# EasyEDA Pro project ACS Core.eprj, schematic RGB Screen
Board Name: RGB Screen; Create Date: 2026-01-16; Page Name: P1; Project Name: ACS Core; Schematic Name: RGB Screen; Update Date: 2026-01-16; Company: EasyEDA.com; Page Size: A4; Version: V1.0
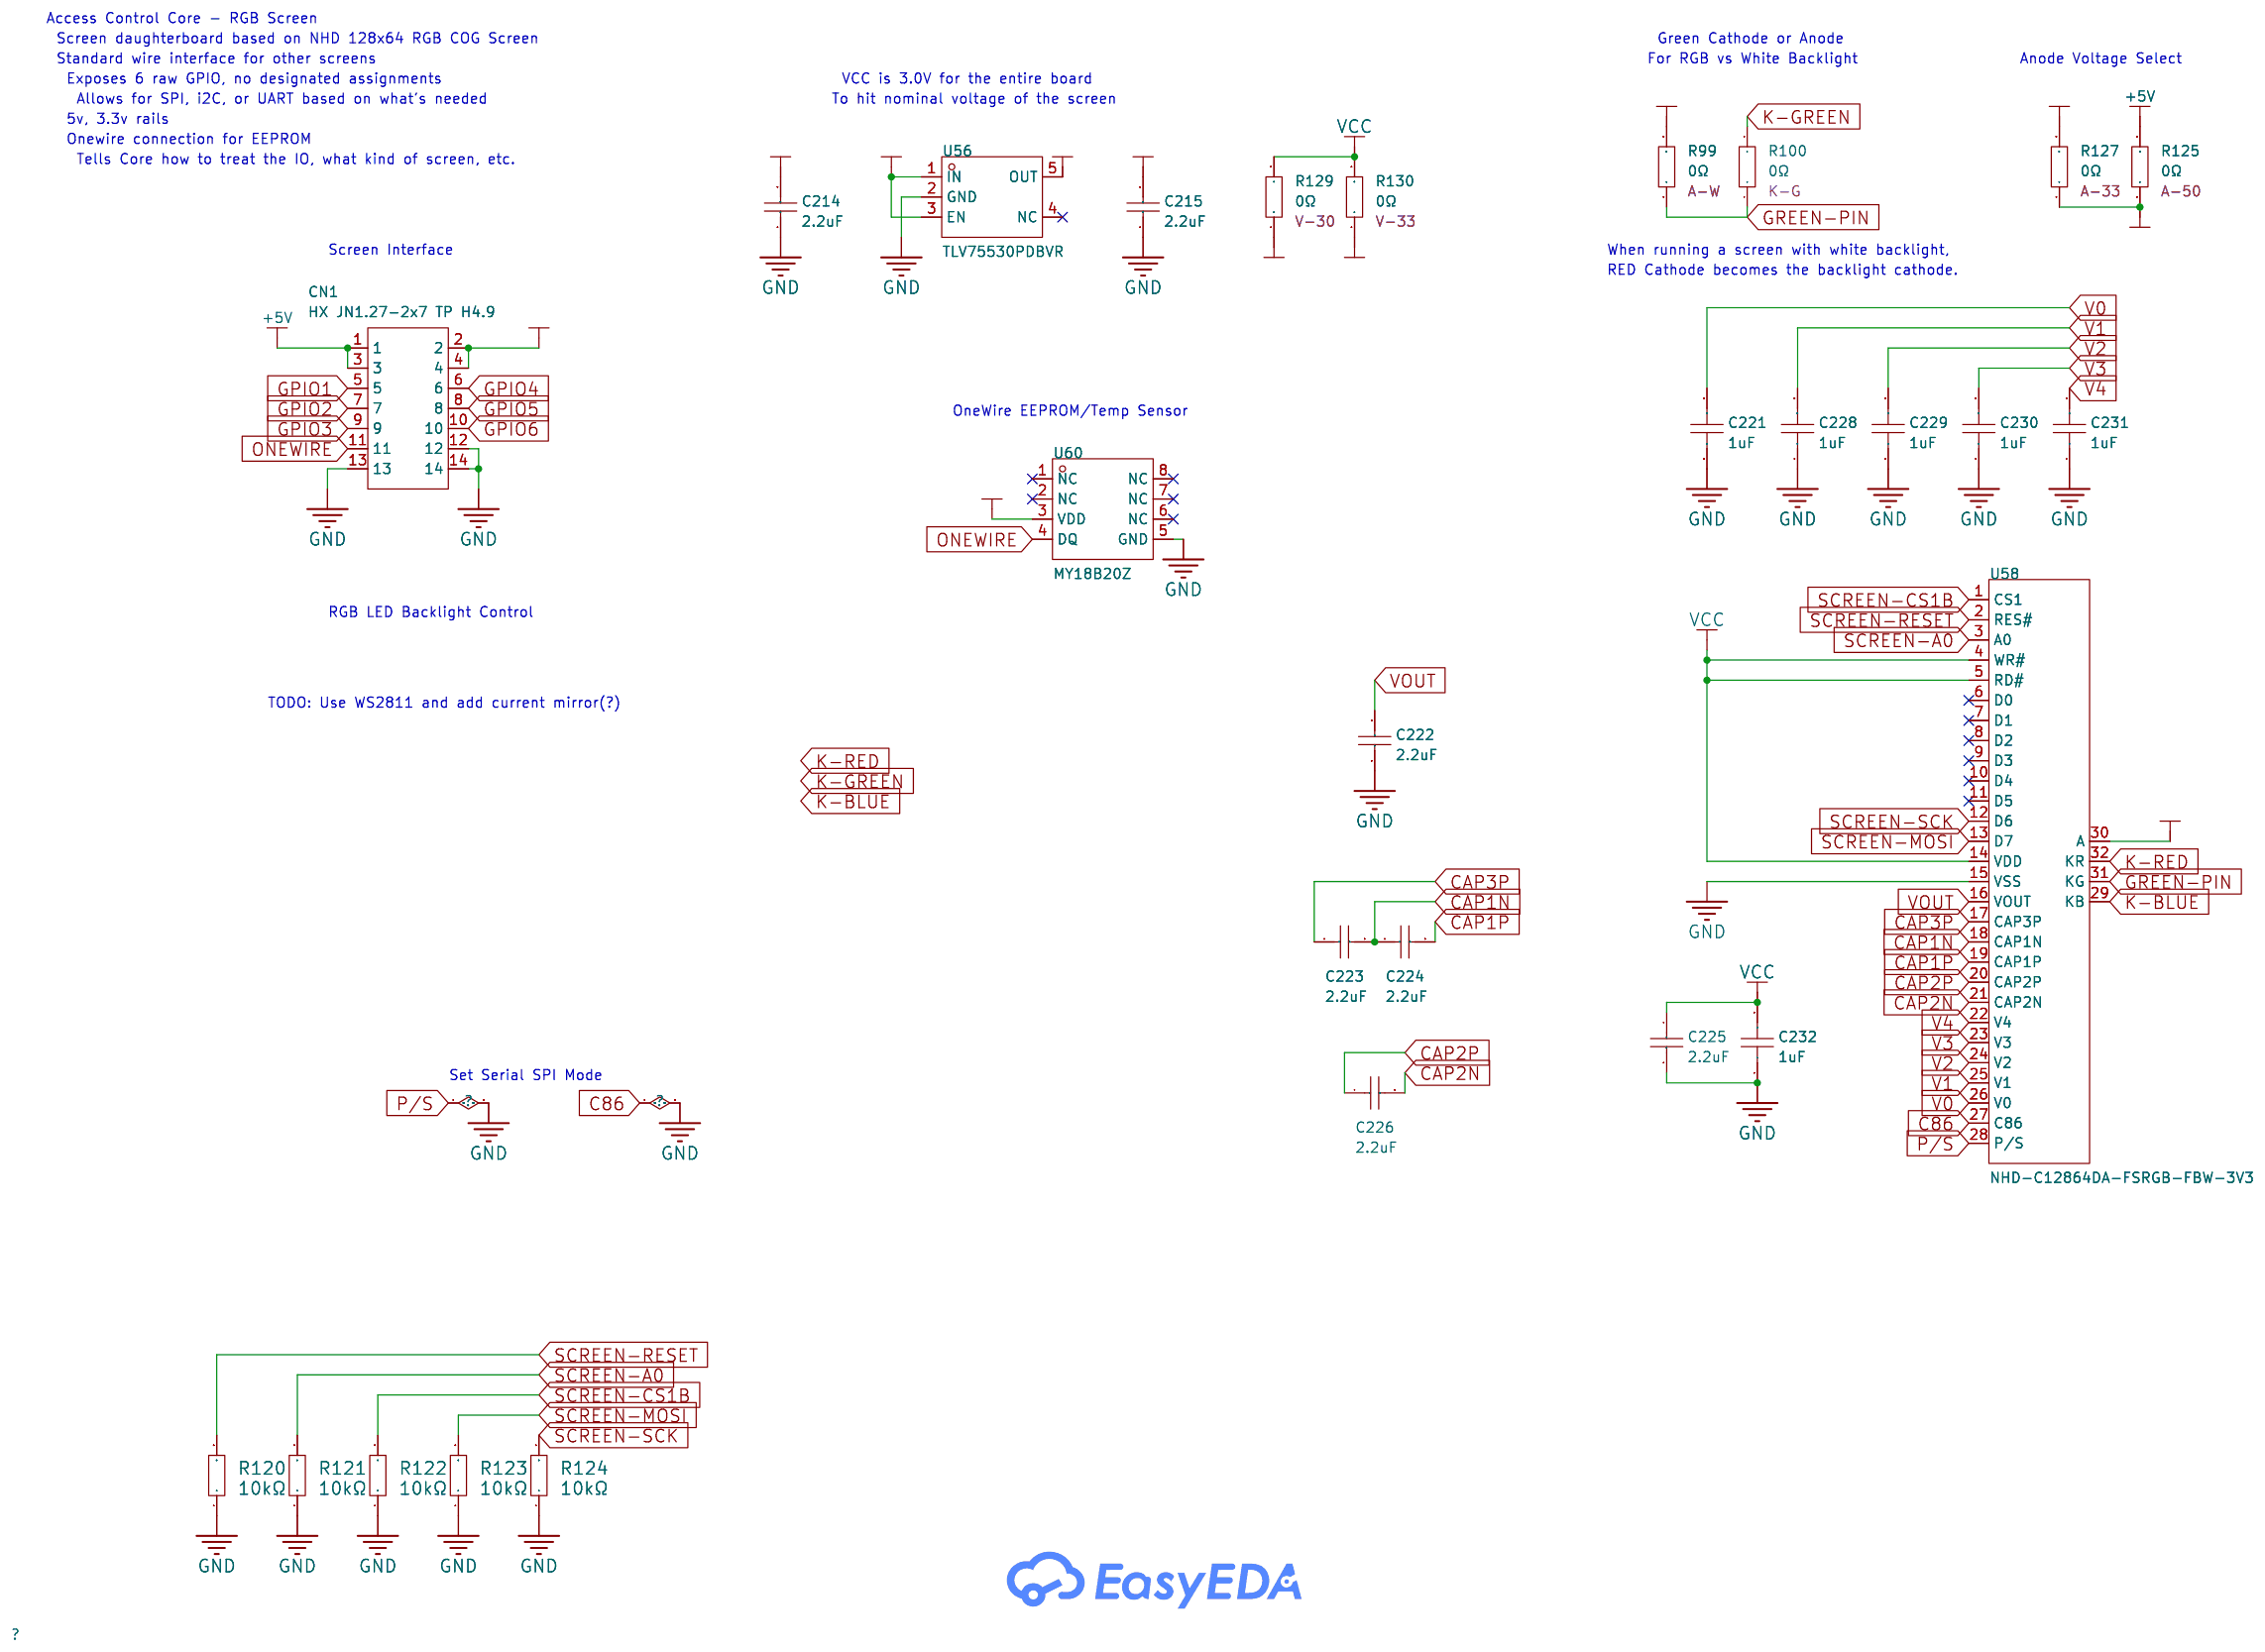
[diagram p6: schematic sheet]

## Parts
C214  2.2uF  [C0603]
C215  2.2uF  [C0603]
C221  1uF  [C0603]
C222  2.2uF  [C0603]
C223  2.2uF  [C0603]
C224  2.2uF  [C0603]
C225  2.2uF  [C0603]
C226  2.2uF  [C0603]
C228  1uF  [C0603]
C229  1uF  [C0603]
C230  1uF  [C0603]
C231  1uF  [C0603]
C232  1uF  [C0603]
CN1  HX JN1.27-2x7 TP H4.9  [IDC-SMD_14P-P1.27_HXJN1.27-14P]
R99  0Ω  [R0805]  (no BOM)
R100  0Ω  [R0805]
R120  10kΩ  [R0603]
R121  10kΩ  [R0603]
R122  10kΩ  [R0603]
R123  10kΩ  [R0603]
R124  10kΩ  [R0603]
R125  0Ω  [R0805]  (no BOM)
R127  0Ω  [R0805]
R129  0Ω  [R0805]
R130  0Ω  [R0805]  (no BOM)
U56  TLV75530PDBVR  [SOT-23-5_L3.0-W1.7-P0.95-LS2.8-BR]
U58  NHD-C12864DA-FSRGB-FBW-3V3  [LCD-TH_L58.2-W41.7-P1.27_NHD-C12864DA-FSRGB-FBW-3V3]
U60  MY18B20Z  [SOP-8_L4.9-W3.9-P1.27-LS6.0-BL]

## Library data of the parts
C214 C215 C222-C226 = CL10A225KO8NNNC: Capacitance:2.2uF Tolerance:±10% Tolerance:±10% Voltage Rating:16V Temperature Coefficient:X5R; LCSC Part Name: 2.2uF ±10% 16V; Supplier Part: C23630; Manufacturer: SAMSUNG(三星); Supplier Footprint: 0603; Datasheet: https://item.szlcsc.com/datasheet/CL10A225KO8NNNC/24366.html; Supplier: LCSC; Tolerance: ±10%; Voltage Rating: 16V; Temperature Coefficient: X5R
C221 C228-C232 = CL10A105KB8NNNC: Capacitance: Tolerance:±10% Tolerance:±10% Voltage Rated: Temperature Coefficient:; LCSC Part Name: 1uF ±10% 50V; Supplier Part: C15849; Manufacturer: SAMSUNG(三星); Supplier Footprint: 0603; JLCPCB Part Class: Basic Part; Datasheet: https://atta.szlcsc.com/upload/public/pdf/source/20160218/1457707763339.pdf; Supplier: LCSC; Tolerance: ±10%; Temperature Coefficient: X5R; Voltage Rating: 50V
CN1 = HX JN1.27-2x7 TP H4.9: LCSC Part Name: 1.27mm 2x7P 排数:2 每排P数:7; Supplier Part: C42455944; Manufacturer: hanxia(韩下); Supplier Footprint: SMD,P=1.27mm; Datasheet: https://item.szlcsc.com/datasheet/HX%2520JN1.27-2x7%2520TP%2520H4.9/44524767.html; Supplier: LCSC; Connector Type: IDC Header; Pitch: 1.27mm; Number of Positions or Pins: 2x7P; Current Rating: 1A; Voltage Rating (Max): 500V; Holder Type: Surface Mount,Vertical; Row Spacing: 1.27mm; Number of Rows: 2; Number of PINs Per Row: 7; Contact Material: Brass; Contact Plating: Gold; Operating Temperature: -40℃~+105℃; Color: Black
R99 = 0805W8F0000T5E_C17477: Type:Thick Film Resistor Resistance:0Ω Tolerance:±1% Tolerance:±1% Power(Watts):125mW Voltage-Supply(Max):150V Temperature Coefficient:±800ppm/℃ Temperature Coefficient:±800ppm/℃ Operating Temperature:-55℃~+155℃ Operating Temperature:-55℃~+155℃; LCSC Part Name: 0Ω ±1% 125mW 厚膜电阻; Supplier Part: C17477; Manufacturer: UNI-ROYAL(厚声); Manufacturer Part: 0805W8F0000T5E; Supplier Footprint: 0805; Datasheet: https://item.szlcsc.com/datasheet/0805W8F0000T5E/18165.html; Supplier: LCSC; Type: Thick Film Resistor; Tolerance: ±1%; Power(Watts): 125mW; Voltage-Supply(Max): 150V; Temperature Coefficient: ±800ppm/℃; Operating Temperature: -55℃~+155℃; Note: A-W
R100 = 0805W8F0000T5E_C17477: Type:Thick Film Resistor Resistance:0Ω Tolerance:±1% Tolerance:±1% Power(Watts):125mW Voltage-Supply(Max):150V Temperature Coefficient:±800ppm/℃ Temperature Coefficient:±800ppm/℃ Operating Temperature:-55℃~+155℃ Operating Temperature:-55℃~+155℃; LCSC Part Name: 0Ω ±1% 125mW 厚膜电阻; Supplier Part: C17477; Manufacturer: UNI-ROYAL(厚声); Manufacturer Part: 0805W8F0000T5E; Supplier Footprint: 0805; Datasheet: https://item.szlcsc.com/datasheet/0805W8F0000T5E/18165.html; Supplier: LCSC; Type: Thick Film Resistor; Tolerance: ±1%; Power(Watts): 125mW; Voltage-Supply(Max): 150V; Temperature Coefficient: ±800ppm/℃; Operating Temperature: -55℃~+155℃; Note: K-G
R120-R124 = 0603WAF1002T5E: Type:Thick Film Resistors Resistance:10kΩ Tolerance:±1% Tolerance:±1% Power(Watts): Overload Voltage (Max): Temperature Coefficient:±100ppm/℃ Temperature Coefficient:±100ppm/℃ Operating Temperature Range:-55℃~+155℃ Operating Temperature Range:-55℃~+155℃; LCSC Part Name: 厚膜电阻 10kΩ ±1% 100mW; Supplier Part: C25804; Manufacturer: UNI-ROYAL(厚声); Supplier Footprint: 0603; JLCPCB Part Class: Basic Part; Datasheet: https://atta.szlcsc.com/upload/public/pdf/source/20200306/C422600_1E6D84923E4A46A82E41ADD87F860B5C.pdf; Supplier: LCSC; Type: Thick Film Resistors; Tolerance: ±1%; Temperature Coefficient: ±100ppm/℃; Operating Temperature Range: -55℃~+155℃
R125 = 0805W8F0000T5E_C17477: Type:Thick Film Resistor Resistance:0Ω Tolerance:±1% Tolerance:±1% Power(Watts):125mW Voltage-Supply(Max):150V Temperature Coefficient:±800ppm/℃ Temperature Coefficient:±800ppm/℃ Operating Temperature:-55℃~+155℃ Operating Temperature:-55℃~+155℃; LCSC Part Name: 0Ω ±1% 125mW 厚膜电阻; Supplier Part: C17477; Manufacturer: UNI-ROYAL(厚声); Manufacturer Part: 0805W8F0000T5E; Supplier Footprint: 0805; Datasheet: https://item.szlcsc.com/datasheet/0805W8F0000T5E/18165.html; Supplier: LCSC; Type: Thick Film Resistor; Tolerance: ±1%; Power(Watts): 125mW; Voltage-Supply(Max): 150V; Temperature Coefficient: ±800ppm/℃; Operating Temperature: -55℃~+155℃; Note: A-50
R127 = 0805W8F0000T5E_C17477: Type:Thick Film Resistor Resistance:0Ω Tolerance:±1% Tolerance:±1% Power(Watts):125mW Voltage-Supply(Max):150V Temperature Coefficient:±800ppm/℃ Temperature Coefficient:±800ppm/℃ Operating Temperature:-55℃~+155℃ Operating Temperature:-55℃~+155℃; LCSC Part Name: 0Ω ±1% 125mW 厚膜电阻; Supplier Part: C17477; Manufacturer: UNI-ROYAL(厚声); Manufacturer Part: 0805W8F0000T5E; Supplier Footprint: 0805; Datasheet: https://item.szlcsc.com/datasheet/0805W8F0000T5E/18165.html; Supplier: LCSC; Type: Thick Film Resistor; Tolerance: ±1%; Power(Watts): 125mW; Voltage-Supply(Max): 150V; Temperature Coefficient: ±800ppm/℃; Operating Temperature: -55℃~+155℃; Note: A-33
R129 = 0805W8F0000T5E_C17477: Type:Thick Film Resistor Resistance:0Ω Tolerance:±1% Tolerance:±1% Power(Watts):125mW Voltage-Supply(Max):150V Temperature Coefficient:±800ppm/℃ Temperature Coefficient:±800ppm/℃ Operating Temperature:-55℃~+155℃ Operating Temperature:-55℃~+155℃; LCSC Part Name: 0Ω ±1% 125mW 厚膜电阻; Supplier Part: C17477; Manufacturer: UNI-ROYAL(厚声); Manufacturer Part: 0805W8F0000T5E; Supplier Footprint: 0805; Datasheet: https://item.szlcsc.com/datasheet/0805W8F0000T5E/18165.html; Supplier: LCSC; Type: Thick Film Resistor; Tolerance: ±1%; Power(Watts): 125mW; Voltage-Supply(Max): 150V; Temperature Coefficient: ±800ppm/℃; Operating Temperature: -55℃~+155℃; Note: V-30
R130 = 0805W8F0000T5E_C17477: Type:Thick Film Resistor Resistance:0Ω Tolerance:±1% Tolerance:±1% Power(Watts):125mW Voltage-Supply(Max):150V Temperature Coefficient:±800ppm/℃ Temperature Coefficient:±800ppm/℃ Operating Temperature:-55℃~+155℃ Operating Temperature:-55℃~+155℃; LCSC Part Name: 0Ω ±1% 125mW 厚膜电阻; Supplier Part: C17477; Manufacturer: UNI-ROYAL(厚声); Manufacturer Part: 0805W8F0000T5E; Supplier Footprint: 0805; Datasheet: https://item.szlcsc.com/datasheet/0805W8F0000T5E/18165.html; Supplier: LCSC; Type: Thick Film Resistor; Tolerance: ±1%; Power(Watts): 125mW; Voltage-Supply(Max): 150V; Temperature Coefficient: ±800ppm/℃; Operating Temperature: -55℃~+155℃; Note: V-33
U56 = TLV75530PDBVR: Output Type:Fixed Voltage - Supply:5.5V Output Voltage:3V Output Voltage:3V Output Current:500mA Power Supply Rejection Ratio (PSRR):46dB@(100kHz) Voltage Dropout:238mV@(500mA) standby current:25uA Features:Over Current Protection；Over Temperature Protect; LCSC Part Name: 具有使能功能的 500mA、高 PSRR、低 IQ、低压降稳压器; Supplier Part: C507268; Manufacturer: TI(德州仪器); Supplier Footprint: SOT-23-5; JLCPCB Part Class: Extended Part; Datasheet: https://www.ti.com/cn/lit/gpn/tlv755p; Supplier: LCSC; Output Type: Fixed; Voltage - Supply: 5.5V; Output Voltage: 3V; Output Current: 500mA; Power Supply Rejection Ratio (PSRR): 46dB@(100kHz); Voltage Dropout: 238mV@(500mA); standby current: 25uA; Features: Over Current Protection；Over Temperature Protection；Short Circuit Protection；Under Voltage Lockout; Operating Temperature: -40℃~+125℃@(Tj); Output Configuration: Positive; Number of Outputs: 1
U58 = NHD-C12864DA-FSRGB-FBW-3V3: Supplier Part: C9900242902; Supplier Footprint: 插件; Supplier: LCSC
U60 = MY18B20Z_C5261093: LCSC Part Name: 单总线数字温度传感器; Supplier Part: C5261093; Manufacturer: Mysentech(敏源传感); Supplier Footprint: SOP-8; JLCPCB Part Class: Extended Part; Datasheet: https://atta.szlcsc.com/upload/public/pdf/source/20240618/394BD6ABB1A01A6071A825ED15B5F58D.pdf; Supplier: LCSC; Temperature Range: -55℃~+125℃; Tolerance: ±0.5℃; Voltage - Supply: 1.8V~5.5V; Standby Current: 0.2uA; Interface: Single Bus

## Nets
+3.0V: C215.2 R129.1 U56.5(OUT)
+3.3V: C214.2 CN1.2 CN1.4 R127.2 R130.1 U56.1(IN) U56.3(EN)
+5V: CN1.1 CN1.3 R125.2 U60.3(VDD)
GND: C214.1 C215.1 C221.1 C222.2 C225.2 C228.1 C229.1 C230.1 C231.1 C232.1 CN1.12 CN1.13 CN1.14 R120.1 R121.1 R122.1 R123.1 R124.1 U56.2(GND) U58.15(VSS) U58.27(C86) U58.28(P/S) U60.5(GND)
V0: C221.2 U58.26(V0)
V1: C228.2 U58.25(V1)
V2: C229.2 U58.24(V2)
V3: C230.2 U58.23(V3)
V4: C231.2 U58.22(V4)
VCC: C225.1 C232.2 R129.2 R130.2 U58.4(WR#) U58.5(RD#) U58.14(VDD)
CAP1N: C223.2 C224.1 U58.18(CAP1N)
CAP1P: C224.2 U58.19(CAP1P)
CAP2N: C226.2 U58.21(CAP2N)
CAP2P: C226.1 U58.20(CAP2P)
CAP3P: C223.1 U58.17(CAP3P)
GPIO1: CN1.5
GPIO2: CN1.7
GPIO3: CN1.9
GPIO4: CN1.6
GPIO5: CN1.8
GPIO6: CN1.10
GREEN-PIN: R99.1 R100.1 U58.31(KG)
K-BLUE: U58.29(KB)
K-GREEN: R100.2
K-RED: U58.32(KR)
ONEWIRE: CN1.11 U60.4(DQ)
SCREEN-A0: R121.2 U58.3(A0)
SCREEN-CS1B: R122.2 U58.1(CS1)
SCREEN-MOSI: R123.2 U58.13(D7)
SCREEN-RESET: R120.2 U58.2(RES#)
SCREEN-SCK: R124.2 U58.12(D6)
VANODE: R99.2 R125.1 R127.1 U58.30(A)
VOUT: C222.1 U58.16(VOUT)

Not connected (* = marked no-connect by the designer): U56 4(NC)*; U58 6(D0)* 7(D1)* 8(D2)* 9(D3)* 10(D4)* 11(D5)*; U60 1(NC)* 2(NC)* 6(NC)* 7(NC)* 8(NC)*

## Notes on the sheet
- Access Control Core - RGB Screen
- Screen daughterboard based on NHD 128x64 RGB COG Screen
- Green Cathode or Anode
- Standard wire interface for other screens
- For RGB vs White Backlight
- Anode Voltage Select
- Exposes 6 raw GPIO, no designated assignments
- VCC is 3.0V for the entire board
- Allows for SPI, i2C, or UART based on what's needed
- To hit nominal voltage of the screen
- 5v, 3.3v rails
- Onewire connection for EEPROM
- Tells Core how to treat the IO, what kind of screen, etc.
- Screen Interface
- When running a screen with white backlight,
- RED Cathode becomes the backlight cathode.
- OneWire EEPROM/Temp Sensor
- RGB LED Backlight Control
- TODO: Use WS2811 and add current mirror(?)
- Set Serial SPI Mode
